# EAGLE design BATT_DCDC (EAGLE 9.6.2)
COMPANY: ADAFRUIT INDUSTRIES; DRAWN: KTOWN; REV: B
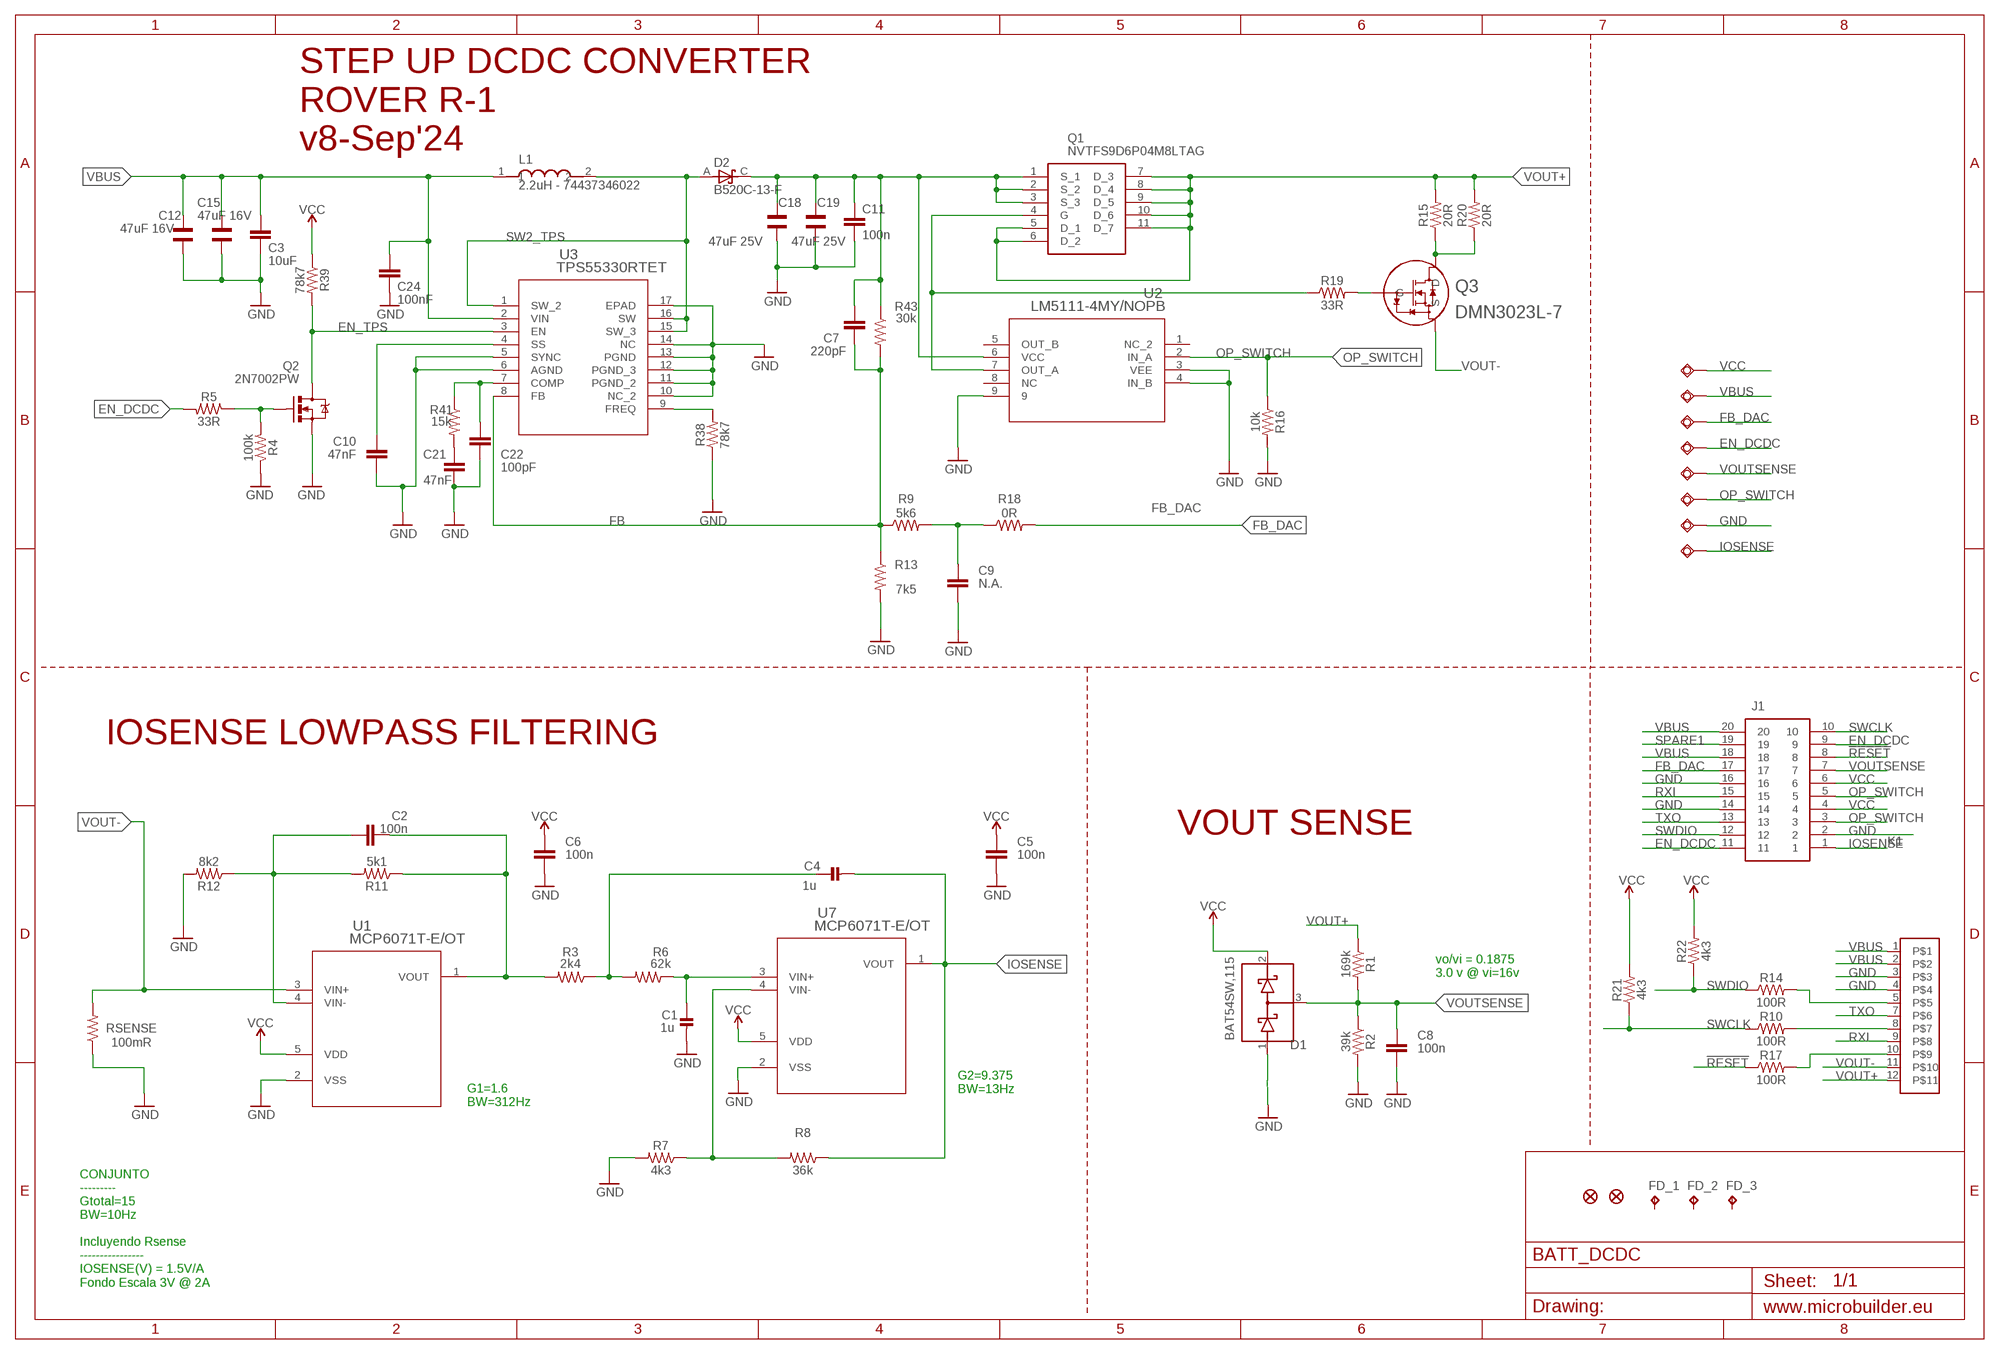
[diagram p0: schematic, sheet 1]

## Parts
C1  1u  CAP_CERAMIC0603_NO  [0603-NO]
C2  100n  0.1UF-0603-25V-(+80/-20%)  [0603]
C3  10uF  10UF-0805-10V-10%  [0805]
C4  1u  CAP_CERAMIC0603_NO  [0603-NO]
C5  100n  0.1UF-0603-25V-(+80/-20%)  [0603]
C6  100n  0.1UF-0603-25V-(+80/-20%)  [0603]
C7  220pF  270PF-0603-50V-5%  [0603]
C8  100n  0.1UF-0603-25V-(+80/-20%)  [0603]
C9  N.A.  0.1UF-0603-25V-(+80/-20%)  [0603]
C10  47nF  47NF-0603-25V-5%  [0603]
C11  100n  0.1UF-0603-25V-(+80/-20%)  [0603]
C12  47uF 16V  WCAP-CSGP_1210_885012109003  [WCAP-CSGP_1210]
C15  47uF 16V  WCAP-CSGP_1210_885012109003  [WCAP-CSGP_1210]
C18  47uF 25V  WCAP-CSGP_1210_885012109003  [WCAP-CSGP_1210]
C19  47uF 25V  WCAP-CSGP_1210_885012109003  [WCAP-CSGP_1210]
C21  47nF  2.2NF/2200PF-0603-50V-10%  [0603]
C22  100pF  270PF-0603-50V-5%  [0603]
C24  100nF  0.1UF-0603-25V-(+80/-20%)  [0603]
D1  BAT54SW,115  [SOT65P210X110-3N]
D2  B520C-13-F  [DIOM7959X250N]
EN_DCDC  TESTPAD_TPSQB1,27  [TESTPAD_B1,27]
FB_DAC  TESTPAD_TPSQB1,27  [TESTPAD_B1,27]
FD_1  FD_1  TPTP06SQ  [TP06SQ]
FD_2  FD_1  TPTP06SQ  [TP06SQ]
FD_3  FD_1  TPTP06SQ  [TP06SQ]
GND  TESTPAD_TPSQB1,27  [TESTPAD_B1,27]
IOSENSE  TESTPAD_TPSQB1,27  [TESTPAD_B1,27]
J1  DF40C-20DP-0.4V_51_  [DF40C-20DPA]
K1  FLEX11  [FLEX11]
L1  2.2uH - 74437346022  74437349100  [INDM7366X500]
OP_SWITCH  TESTPAD_TPSQB1,27  [TESTPAD_B1,27]
Q1  NVTFS9D6P04M8LTAG  [NVTFS5124PLTWG]
Q2  2N7002PW  MOSFET-NCHANNEL2N7002PW  [SOT323]
Q3  DMN3023L-7  PMV20XNERSOT23-TO-236AB_NEX-L  [SOT23-TO-236AB_NEX-L]
R1  169k  RESISTOR0402  [0402]
R2  39k  RESISTOR0402  [0402]
R3  2k4  RESISTOR0603  [0603]
R4  100k  RESISTOR0402  [0402]
R5  33R  RESISTOR0402  [0402]
R6  62k  RESISTOR0603  [0603]
R7  4k3  RESISTOR0603  [0603]
R8  36k  RESISTOR0603  [0603]
R9  5k6  RESISTOR0402  [0402]
R10  100R  RESISTOR0402  [0402]
R11  5k1  RESISTOR0402  [0402]
R12  8k2  RESISTOR0402  [0402]
R13  7k5  RESISTOR0402  [0402]
R14  100R  RESISTOR0402  [0402]
R15  20R  RESISTOR1206  [1206]
R16  10k  RESISTOR0402  [0402]
R17  100R  RESISTOR0402  [0402]
R18  0R  RESISTOR0402  [0402]
R19  33R  RESISTOR0402  [0402]
R20  20R  RESISTOR1206  [1206]
R21  4k3  RESISTOR0603  [0603]
R22  4k3  RESISTOR0402  [0402]
R38  78k7  RESISTOR0402  [0402]
R39  78k7  RESISTOR0402  [0402]
R41  15k  RESISTOR0402  [0402]
R43  30k  RESISTOR0402  [0402]
RSENSE  100mR  RESISTOR1206  [1206]
U1  MCP6071T-E/OT  [SOT-23-5_MC_MCH]
U2  LM5111-4MY/NOPB  [MUY08A]
U3  TPS55330RTET  [RTE16_1P66X1P66_TEX]
U7  MCP6071T-E/OT  [SOT-23-5_MC_MCH]
U$1  FIDUCIAL""  [FIDUCIAL_1MM]
U$2  FIDUCIAL""  [FIDUCIAL_1MM]
VBUS  TESTPAD_TPSQB1,27  [TESTPAD_B1,27]
VCC  TESTPAD_TPSQB1,27  [TESTPAD_B1,27]
VOUTSENSE  TESTPAD_TPSQB1,27  [TESTPAD_B1,27]

## Nets
!RESET: J1.8 R17.1
COMP_TPS: C22.2 R41.1 U3.7(COMP)
EN_DCDC: EN_DCDC.TP J1.9 J1.11 R5.2
EN_TPS: Q2.3(D) R39.2 U3.3(EN)
FB: C7.1 R9.1 R13.1 R43.2 U3.8(FB)
FB_DAC: FB_DAC.TP J1.17 R18.2
FREQ_TPS: R38.2 U3.9(FREQ)
GND: C1.2 C3.1 C5.2 C6.2 C8.2 C9.2 C10.2 C11.2 C12.1 C15.1 C18.1 C19.1 C21.1 C22.1 C24.1 D1.1(A) GND.TP J1.2 J1.14 J1.16 K1.3 K1.4 Q2.2(S) R2.2 R4.1 R7.2 R12.2 R13.2 R16.2 R38.1 RSENSE.1 U1.2(VSS) U2.3(VEE) U2.4(IN_B) U2.9 U3.5(SYNC) U3.6(AGND) U3.10(NC_2) U3.11(PGND_2) U3.12(PGND_3) U3.13(PGND) U3.14(NC) U3.17(EPAD) U7.2(VSS)
IOSENSE: C4.2 IOSENSE.TP J1.1 R8.1 U7.1(VOUT)
ISENSE_RAW: C2.1 R3.2 R11.1 U1.1(VOUT)
N$1: C2.2 R11.2 R12.1 U1.4(VIN-)
N$2: R7.1 R8.2 U7.4(VIN-)
N$3: C4.1 R3.1 R6.2
N$4: Q2.1(G) R4.2 R5.1
N$5: C1.1 R6.1 U7.3(VIN+)
N$6: K1.8 R10.2
N$8: Q3.3(D) R15.1 R20.1
N$9: Q1.4(G) R19.1 U2.7(OUT_A)
N$10: K1.10 R17.2
N$11: K1.5 R14.2
N$12: C9.1 R9.2 R18.1
N$13: Q3.1(G) R19.2
N$35: C10.1 U3.4(SS)
N$43: C21.2 R41.2
OP_SWITCH: J1.3 J1.5 OP_SWITCH.TP R16.1 U2.2(IN_A)
RXI: J1.15 K1.9
SPARE1: J1.19
SW2_TPS: D2.A L1.2 U3.1(SW_2) U3.15(SW_3) U3.16(SW)
SWCLK: J1.10 R10.1 R21.1
SWDIO: J1.12 R14.1 R22.1
TXO: J1.13 K1.7
VBUS: C3.2 C12.2 C15.2 C24.2 J1.18 J1.20 K1.1 K1.2 L1.1 U3.2(VIN) VBUS.TP
VCC: C5.1 C6.1 D1.2(C) J1.4 J1.6 R21.2 R22.2 R39.1 U1.5(VDD) U7.5(VDD) VCC.TP
VOUT+: K1.12 Q1.5(D_1) Q1.6(D_2) Q1.7(D_3) Q1.8(D_4) Q1.9(D_5) Q1.10(D_6) Q1.11(D_7) R1.1 R15.2 R20.2
VOUT-: K1.11 Q3.2(S) RSENSE.2 U1.3(VIN+)
VOUTSENSE: C8.1 D1.3(A-C) J1.7 R1.2 R2.1 VOUTSENSE.TP
VSOURCE: C7.2 C11.1 C18.2 C19.2 D2.C Q1.1(S_1) Q1.2(S_2) Q1.3(S_3) R43.1 U2.6(VCC)
Unconnected: FD_1.TP FD_2.TP FD_3.TP U2.1(NC_2) U2.5(OUT_B) U2.8(NC)

## Notes on the sheet
- STEP UP DCDC CONVERTER
  ROVER R-1
  v8-Sep'24
- IOSENSE LOWPASS FILTERING
- VOUT SENSE
- vo/vi = 0.1875
  3.0 v @ vi=16v
- G2=9.375
  BW=13Hz
- G1=1.6
  BW=312Hz
- CONJUNTO
  ---------
  Gtotal=15
  BW=10Hz
  
  Incluyendo Rsense
  ----------------
  IOSENSE(V) = 1.5V/A
  Fondo Escala 3V @ 2A

## Library data of the parts
C1 C4 = microbuilder:CAP_CERAMIC: Ceramic Capacitors For new designs, use the packages preceded by an '_' character since they are more reliable: The following footprints should be used on most boards: _0402 - Standard footprint for regular board layouts _0603 - Standard footprint for regular board layouts _0805 - Standard footprint for regular board layouts _1206 - Standard footprint for regular board layouts For extremely tight-pitch boards where space is at a premium, the following 'micro-pitch' footprints can be used (smaller pads, no silkscreen outline, etc.): _0402MP - Micro-pitch footprint for very dense/compact boards _0603MP - Micro-pitch footprint for very dense/compact boards _0805MP - Micro-pitch footprint for very dense/compact boards _1206MP - Micro-pitch footprint for very dense/compact boards
C2 C5 C6 C8 C9 C11 C24 = SparkFun-Capacitors:0.1UF: 0.1µF ceramic capacitors A capacitor is a passive two-terminal electrical component used to store electrical energy temporarily in an electric field.; PROD_ID: CAP-00810; VALUE: 0.1uF
C3 = SparkFun-Capacitors:10UF: 10.0µF ceramic capacitors A capacitor is a passive two-terminal electrical component used to store electrical energy temporarily in an electric field.; PROD_ID: CAP-11330
C7 C22 = SparkFun-Capacitors:270PF: 270pF/0.27nF ceramic capacitors A capacitor is a passive two-terminal electrical component used to store electrical energy temporarily in an electric field.; PROD_ID: CAP-13339; VALUE: 270PF
C10 = SparkFun-Capacitors:47NF: 47nF ceramic capacitors A capacitor is a passive two-terminal electrical component used to store electrical energy temporarily in an electric field.; PROD_ID: CAP-08605
C12 C15 C18 C19 = Wurth_Elektronik_Passive_Capacitors_rev19a:WCAP-CSGP_1210: WCAP-CSGP Ceramic Capacitors Characteristics Multilayer Ceramic Chip Capacitor Recommended soldering:Reflow, for 0603 and 0805 wave soldering is also allowed Operating temperature:-55 °C to +125 °C; Ceramic characteristics: Class I - NPO ; Class II -X7R, X5R High performance ceramic High capacitance stability Minimal aging Termination:Cu/Ni/Sn <http://katalog.we-online.de/media/images/eisos/WCAP-CSGP_pf2.jpg> Details see: http://katalog.we-online.de/en/pbs/WCAP-CSGP-1210? Created: 2015-01-28 2015 (C) Wurth Elektronik; WE-NUMBER: 885012109003/47uF
C21 = SparkFun-Capacitors:2.2NF/2200PF: 2.2nF/2,200pF ceramic capacitors A capacitor is a passive two-terminal electrical component used to store electrical energy temporarily in an electric field.; PROD_ID: CAP-07877; VALUE: 2.2nF
D1 = BAT54SW_115:BAT54SW,115: BAT54W Series 30 V 600 mA SMT Schottky Barrier Double Diode -SOT-323 Check availability <https://pricing.snapeda.com/parts/BAT54SW%2C115/Nexperia%20USA%20Inc./view-part?ref=eda>; AVAILABILITY: In Stock; DESCRIPTION: Diode Array 1 Pair Series Connection Schottky 30 V 200mA (DC) Surface Mount SC-70, SOT-323; MF: Nexperia USA Inc.; MP: BAT54SW,115; PACKAGE: SOT-323 Nexperia USA Inc.; PRICE: None; PURCHASE-URL: https://pricing.snapeda.com/search/part/BAT54SW,115/?ref=eda
D2 = B520C-13-F:B520C-13-F: 5.0A SURFACE MOUNT SCHOTTKY BARRIER RECTIFIER; AVAILABILITY: Unavailable; DESCRIPTION: Diode Schottky 20V 5A Surface Mount SMC; DIGIKEY-PURCHASE-URL: https://snapeda.com/shop?store=DigiKey&id=325969; MF: Diodes Inc.; MP: B520C-13-F; PACKAGE: DO-214 Diodes Inc.; PRICE: None
EN_DCDC FB_DAC GND IOSENSE OP_SWITCH VBUS VCC VOUTSENSE = BeagleBone_Blue_R3:TESTPAD_TPSQ: Test pad
FD_1-FD_3 = testpad:TP: Test pad
J1 = DF40C-20DP-0.4V_51_:DF40C-20DP-0.4V_51_: HIROSE(HRS) - DF40C-20DP-0.4V(51) - CONNECTOR, STACKING, HEADER, 20POS, 2ROW Source: Datasheet <https://datasheet.datasheetarchive.com/originals/distributors/Datasheets-DGA17/1059795.pdf>; ARROW_PART_NUMBER: DF40C-20DP-0.4V(51); ARROW_PRICE-STOCK: https://www.arrow.com/en/products/df40c-20dp-0.4v-51/hirose-electric; DESCRIPTION: HIROSE(HRS) - DF40C-20DP-0.4V(51) - CONNECTOR, STACKING, HEADER, 20POS, 2ROW; HEIGHT: mm; MANUFACTURER_NAME: Hirose; MANUFACTURER_PART_NUMBER: DF40C-20DP-0.4V(51); MOUSER_PART_NUMBER: 798-DF40C20DP0.4V51; MOUSER_PRICE-STOCK: https://www.mouser.co.uk/ProductDetail/Hirose-Connector/DF40C-20DP-0.4V51?qs=eDUdFcBPps31lPFyZ%252BXRFg%3D%3D
K1 = Flex_3mm:FLEX11
L1 = Inductance_2.2uH:74437349100: Inductor, SMD [Würth Elektronik] 74437349100 Inductor, SMD; DESCRIPTION: 10µH Shielded Molded Inductor 3.2A 69mOhm Max Nonstandard; DIGIKEY-PURCHASE-URL: https://snapeda.com/shop?store=DigiKey&id=586788; MF: Wurth Electronics; MP: 74437349100; PACKAGE: Nonstandard Wurth Electronics
Q1 = SamacSys_Parts:NVTFS9D6P04M8LTAG: MOSFET MV8 P INITIAL PROGRAM Source: Datasheet <https://www.onsemi.com/pub/Collateral/NVTFS9D6P04M8L-D.PDF>; DESCRIPTION: MOSFET MV8 P INITIAL PROGRAM; HEIGHT: 0.8mm; MANUFACTURER_NAME: ON Semiconductor; MANUFACTURER_PART_NUMBER: NVTFS9D6P04M8LTAG; MOUSER_PART_NUMBER: 863-NVTFS9D6P04M8LTG; MOUSER_PRICE-STOCK: https://www.mouser.co.uk/ProductDetail/ON-Semiconductor/NVTFS9D6P04M8LTAG/?qs=xZ%2FP%252Ba9zWqYALd8g5rll2Q%3D%3D
Q2 = SparkFun-DiscreteSemi:MOSFET-NCHANNEL: Common NMOSFET Parts MFG P/N Store ID Prod ID FDD8780 TRANS-09984 SI7820DN TRANS-11055 FDS6630A IC-08089 2N7002PW TRANS-11151 FQP30N06L COM-10213 TRANS-10060 BSS123LT1G TRANS-08345 BSS138 TRANS-00830 BS170 2N7000; PROD_ID: TRANS-11151
Q3 = PMV20XNER:PMV20XNER; COPYRIGHT: Copyright (C) 2023 Ultra Librarian. All rights reserved.; MANUFACTURER_PART_NUMBER: PMV20XNER; MFR_NAME: Nexperia
R1-R22 R38 R39 R41 R43 RSENSE = SparkFun-Resistors:RESISTOR: Generic Resistor Package
U1 U7 = MCP6071:MCP6071T-E/OT; BUILT_BY: EMA_Jessica; COPYRIGHT: Copyright (C) 2018 Accelerated Designs. All rights reserved; MANUFACTURER_PART_NUMBER: MCP6071T-E/OT; SOURCELIBRARY: Microchip_2019-08-23_21; VENDOR: Microchip
U2 = LM5111-4MY:LM5111-4MY/NOPB; COPYRIGHT: Copyright (C) 2024 Ultra Librarian. All rights reserved.; MANUFACTURER_PART_NUMBER: LM5111-4MY/NOPB; MFR_NAME: Texas Instruments; TYPE: LM5111-1MY
U3 = TPS55330:TPS55330RTET; BUILT_BY: EMA_UL_Team; MANUFACTURER_PART_NUMBER: TPS55330RTET; SOURCELIBRARY: TI_2015-1-5; VENDOR: Texas Instruments
U$1 U$2 = microbuilder:FIDUCIAL: Fiducial Alignment Points Various fiducial points for machine vision alignment.; BOM: EXCLUDE

## Net classes
2 gnd: width 0.305 mm, drill 0.483 mm, clearance 0.203 mm

## Board
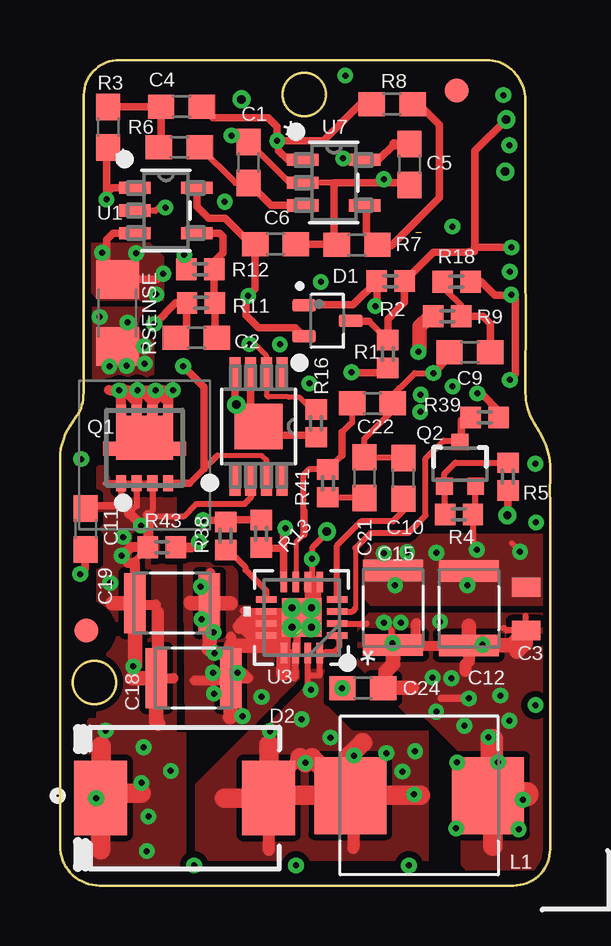
[diagram p1: board, top side]
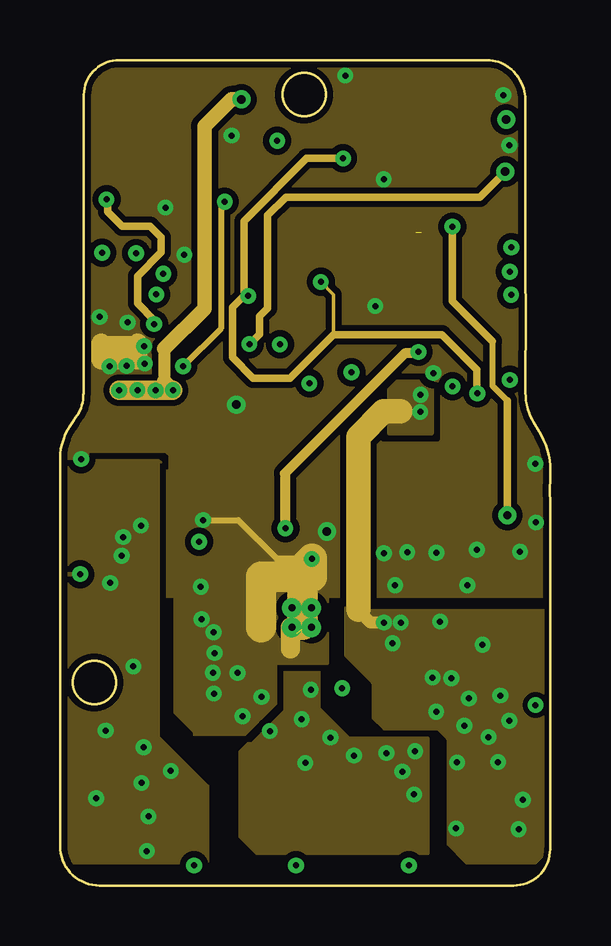
[diagram p2: board, inner layer Route2]
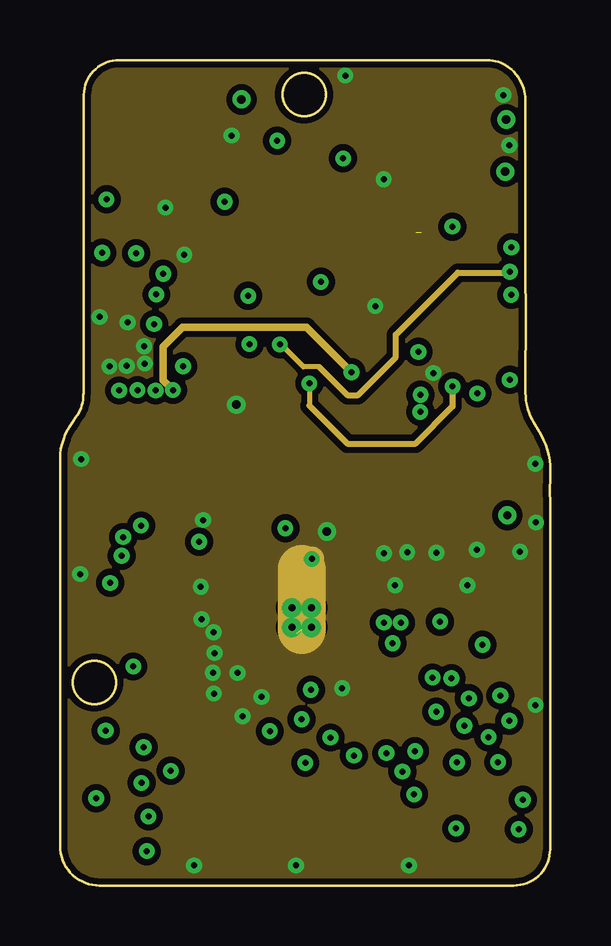
[diagram p3: board, inner layer Route15]
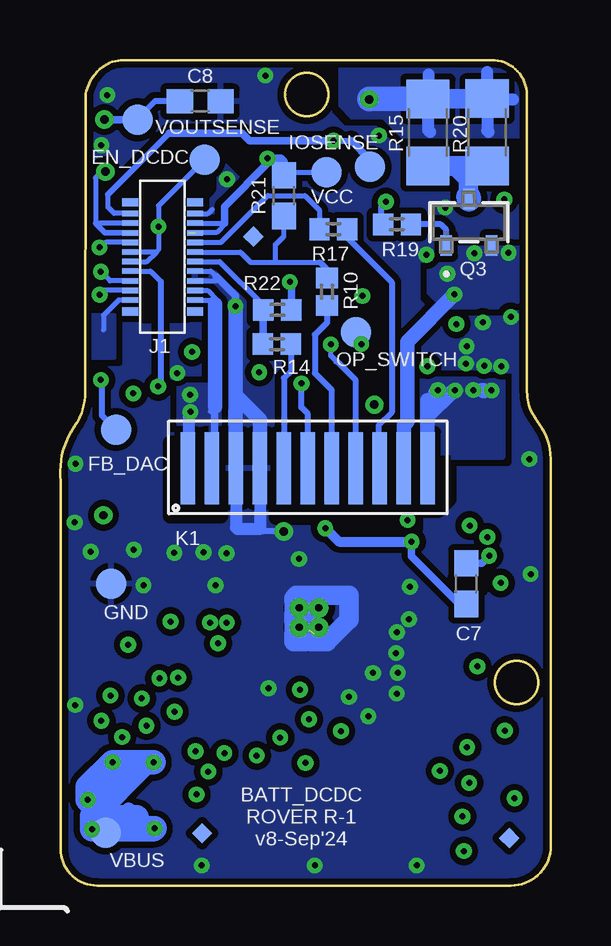
[diagram p4: board, bottom side, seen from below]

Size 20.45 x 34.4 mm. Coordinates in mm from the lower left corner, seen from the top.
Outline: 2.47,34.4 17.81,34.39 arc-37 18.71,34.1 arc-28 19.26,33.42 arc-25 19.4,32.76 arc0 19.4,30.25 arc0 19.4,27.73 arc1 19.41,25.27 arc-1 19.41,21.7 arc1 19.41,20.55 arc19 19.57,19.68 arc14 19.8,19.22 arc-8 20.16,18.59 arc-24 20.44,17.48 arc-4 20.44,16.88 arc4 20.44,16.05 20.44,1.52 arc-90 18.91,0 1.66,0 arc-90 0,1.65 arc90 0.01,1.66 0.01,17.78 arc-34 0.44,19.17 arc2 0.77,19.69 arc30 0.97,20.36 arc-23 1,20.54 1,32.94 arc-90 2.47,34.4
Outline: circle at 10.18,32.96 radius 0.9
Outline: circle at 1.43,8.46 radius 0.9
Copper layers (1+2*15+16): Top 0.035mm / dielectric 1.5mm / Route2 0.035mm / dielectric 0.15mm / Route15 0.035mm / dielectric 0.2mm / Bottom 0.035mm
Design rules "adafruit *": minimum track width 0.15mm, minimum drill 0.25mm, track to track 8mil, track to pad 8mil, pad to pad 8mil, via to via 8mil, smd to smd 5mil, copper to edge 8mil, drill to drill 8mil, minimum pad ring 10mil, minimum via ring 8mil, stop-mask expansion 2mil, vias tented up to drill 20mil, thermal gap 10mil
tRestrict: area 2.3,17.3 to 4.9,17.5
bRestrict: area 5.6,14.9 to 6.3,15.6; area 2.9,12.2 to 4,12.8; area 15.2,23.7 to 15.9,28.6; area 7,19.7 to 7.7,20.4; area 14.4,32.1 to 14.9,33.1; area 16.6,23.7 to 16.9,25.1; area 6.6,15.3 to 11.4,15.6; area 13.7,15.4 to 15.9,18.5; area 4.2,15.6 to 5.4,17.9; area 9.5,19.1 to 10,20.5; area 14.3,28.9 to 15.2,29.4; area 12.5,29.8 to 13.5,30.5

### Footprints (pad centres in the part's own frame; a part is rotated, then mirrored left to right if it is on the bottom)
0603-NO = smd 1.1 x 1: 1 -0.85,0; 2 0.85,0
0603 = smd 1.1 x 1: 1 -0.85,0; 2 0.85,0
0805 = smd 0.8 x 1.2: 1 -0.9,0; 2 0.9,0
WCAP-CSGP_1210 = smd 0.9 x 2.5: 1 -1.55,0; 2 1.55,0
SOT65P210X110-3N = smd 0.99 x 0.5: 1 -0.97,0.65; 2 -0.97,-0.65; 3 0.97,0
DIOM7959X250N = smd 2.2 x 3.1: A 3.5,0; C -3.5,0
TESTPAD_B1,27 = smd 1.27 x 1.27: TP 0,0
TP06SQ = smd 0.6 x 0.6: TP 0,0
DF40C-20DPA = smd 0.23 x 0.66: 1 0,0; 2 0,2.71; 3 0.4,0; 4 0.4,2.71; 5 0.8,0; 6 0.8,2.71; 7 1.2,0; 8 1.2,2.71; 9 1.6,0; 10 1.6,2.71; 11 2,0; 12 2,2.71; 13 2.4,0; 14 2.4,2.71; 15 2.8,0; 16 2.8,2.71; 17 3.2,0; 18 3.2,2.71; 19 3.6,0; 20 3.6,2.71 | smd 0.35 x 0.66: 21 4.075,0; 22 4.075,2.71; 23 -0.475,2.71; 24 -0.475,0
FLEX11 = smd 0.6 x 3: 1 0.8,2.05; 2 1.8,2.05; 3 2.8,2.05; 4 3.8,2.05; 5 4.8,2.05; 7 5.8,2.05; 8 6.8,2.05; 9 7.8,2.05; 10 8.8,2.05; 11 9.8,2.05; 12 10.8,2.05
INDM7366X500 = smd 3 x 3.2: 1 -2.87,0; 2 2.87,0
NVTFS5124PLTWG = smd 0.42 x 0.66: 1 -0.975,-1.47; 2 -0.325,-1.47; 3 0.325,-1.47; 4 0.975,-1.47 | smd 0.42 x 0.47: 5 0.975,1.565; 6 0.325,1.565; 7 -0.325,1.565; 8 -0.975,1.565 | smd 2.37 x 1.83: 9 0,0.415 | smd 0.545 x 0.57: 10 1.458,-0.035; 11 -1.458,-0.035
SOT323 = smd 0.7 x 0.7: 1 -0.65,-0.925; 2 0.65,-0.925; 3 0,0.925
SOT23-TO-236AB_NEX-L = smd 0.483 x 0.864: 1 -0.95,-0.965; 2 0.95,-0.965; 3 0,0.965
0402 = smd 0.85 x 0.9: 1 -0.58,0; 2 0.58,0
1206 = smd 1.6 x 1.8: 1 -1.4,0; 2 1.4,0
SOT-23-5_MC_MCH = smd 1.31 x 0.508: 1 -1.295,0.95; 2 -1.295,0; 3 -1.295,-0.95; 4 1.295,-0.95; 5 1.295,0.95
MUY08A = smd 1.372 x 0.457: 1 -2.197,0.975; 2 -2.197,0.325; 3 -2.197,-0.325; 4 -2.197,-0.975; 5 2.197,-0.975; 6 2.197,-0.325; 7 2.197,0.325; 8 2.197,0.975 | smd 1.88 x 2.007: 9 0,0
RTE16_1P66X1P66_TEX = smd 0.85 x 0.28: 1 -1.475,0.75; 2 -1.475,0.25; 3 -1.475,-0.25; 4 -1.475,-0.75; 9 1.475,-0.75; 10 1.475,-0.25; 11 1.475,0.25; 12 1.475,0.75 | smd 0.28 x 0.85: 5 -0.75,-1.475; 6 -0.25,-1.475; 7 0.25,-1.475; 8 0.75,-1.475; 13 0.75,1.475; 14 0.25,1.475; 15 -0.25,1.475; 16 -0.75,1.475 | smd 1.66 x 1.6: 17 0,0 | drill 0.305 pad 0.508: V -0.406,-0.406; V_1 -0.406,0.406; V_2 0.406,-0.406; V_3 0.406,0.406
FIDUCIAL_1MM = smd 1 x 1: 1 0,0

### Placement (x,y rotation side)
C1  7.87,30.13 90 top
C2  5.69,22.82 0 top
C3  19.43,11.53 270 top
C4  5.07,32.46 0 top
C5  14.57,30.05 270 top
C6  8.99,26.72 0 top
C7  3.52,12.58 90 bottom
C8  14.62,32.68 0 bottom
C9  17.09,22.23 180 top
C10  14.32,16.97 90 top
C11  1.07,14.86 270 top
C12  17.05,11.56 270 top
C15  13.89,11.58 270 top
C18  5.57,8.64 180 top
C19  4.68,11.77 180 top
C21  12.69,17 270 top
C22  13.03,20.09 180 top
C24  12.63,8.22 0 top
D1  11.15,23.53 0 top
D2  5.2,3.65 0 top
EN_DCDC  14.44,30.25 0 bottom
FB_DAC  18.13,19 0 bottom
FD_1  12.4,27.04 315 bottom
FD_2  1.73,1.98 315 bottom
FD_3  14.54,2.18 315 bottom
GND  18.34,12.58 0 bottom
IOSENSE  7.53,29.95 0 bottom
J1  17.55,28 270 bottom
K1  15.93,15.34 0 bottom
L1  14.98,3.75 180 top
OP_SWITCH  8.12,23.06 0 bottom
Q1  3.53,18.24 0 top
Q2  16.68,17.56 0 top
Q3  3.41,27.64 0 bottom
R1  13.67,22.15 90 top
R2  13.79,25.19 180 top
R3  2.01,31.6 270 top
R4  16.64,15.47 180 top
R5  18.68,17.04 270 top
R6  4.98,30.77 180 top
R7  12.39,26.7 180 top
R8  13.85,32.56 0 top
R9  16.15,23.73 0 top
R10  9.33,24.75 270 bottom
R11  5.88,24.28 0 top
R12  5.85,25.68 180 top
R13  8.39,14.66 90 top
R14  11.42,22.57 0 bottom
R15  5.12,31.38 90 bottom
R16  10.68,19.26 270 top
R17  9.07,27.35 0 bottom
R18  16.54,25.16 0 top
R19  6.41,27.55 0 bottom
R20  2.65,31.39 90 bottom
R21  11.13,28.75 90 bottom
R22  11.4,23.99 0 bottom
R38  6.91,14.57 270 top
R39  17.71,19.5 180 top
R41  11.17,16.76 270 top
R43  4.25,14.1 0 top
RSENSE  2.4,23.86 90 top
U1  4.42,28.13 0 top
U2  8.28,19.13 270 top
U3  10.08,11.17 180 top
U7  11.42,29.29 0 top
U$1  16.55,33.13 90 top
U$2  1.1,10.63 90 top
VBUS  18.56,2.2 0 bottom
VCC  9.35,29.73 0 bottom
VOUTSENSE  17.23,31.91 0 bottom

### Tracks (layer width: path | path; a pad name or v marks a point on that pad's centre or on a via)
!RESET
  Bottom 0.203: J1.8 13.76,26.8 11.8,28.75 10.26,28.75 9.65,28.14 R17.1
COMP_TPS
  Top 0.203: U3.7 9.85,12.66 9.85,14.3 10.18,14.63
  Top 0.254: C22.2 12.18,19.3 11.76,18.88 | 11.76,17.93 R41.1 10.38,17.34 10.14,17.1 10.14,15.63 10.18,15.59
  Top 0.305: 10.18,14.63 10.18,15.59 | 11.76,18.88 11.76,17.93
EN_DCDC  (via drill 0.25, 0.35)
  Top 0.203: 18.68,15.45 v18.66,15.43
  Top 0.305: R5.2 18.68,15.45
  Route2 0.203: v16.37,27.45 v16.36,27.46
  Route2 0.254: 18.04,22.68 18.04,20.82 18.66,20.2
  Route2 0.305: v18.66,15.43 18.66,20.2 | v16.37,27.45 16.37,24.34 18.04,22.68
  Bottom 0.203: 16.45,26.4 16.36,26.48 v16.36,27.46 16.36,28.33 EN_DCDC.TP | J1.11 16.85,26 16.45,26.4 | 16.45,26.4 J1.9
EN_TPS
  Top 0.203: 12.32,14.06 12.32,11.55 | Q2.3 16.7,18.5 16.7,18.54 16.73,18.54 | R39.2 16.84,19.5 16.73,19.4
  Top 0.254: U3.3 12.19,11.42 12.32,11.55 | 12.32,14.06 12.95,14.69 14.52,14.69 15.24,15.42 15.24,17.79 16,18.54 16.7,18.54
  Top 0.305: 16.73,19.4 16.73,18.54
FB  (via drill 0.25)
  Top 0.203: 5.75,14.33 v5.8,14.33 | v9.4,14.89 9.38,14.89 9.33,14.84
  Top 0.305: 9.33,14.84 9.33,14.05 | 9.33,14.05 U3.8 | 9.33,14.05 8.42,14.05 R13.1
  Top 0.406: R43.2 5.52,14.1 5.75,14.33
  Top 0.61: R9.1 15.54,23.69 15.4,23.69 14.99,23.28 14.99,22.27 v14.95,22.23
  Route2 0.406: v14.95,22.23 14.95,22.18 14.38,22.18 9.38,17.18 9.38,14.91 v9.4,14.89
  Bottom 0.305: v5.8,14.33 5.8,13.73 3.8,11.73 C7.1
  Bottom 0.406: v9.4,14.89 8.84,14.33 v5.8,14.33
FB_DAC  (via drill 0.25)
  Top 0.305: v18.76,21.07 18.99,21.3 18.99,24.43 v18.82,24.61 18.8,24.6 18.14,24.6 17.58,25.16 R18.2
  Bottom 0.203: J1.17 18.63,24.8 v18.82,24.61 | v18.76,21.07 18.72,21.03
  Bottom 0.254: 18.72,21.03 18.72,19.59 FB_DAC.TP
FREQ_TPS
  Top 0.203: U3.9 8.6,11.93
  Top 0.254: 8.6,11.93 8.6,12.3 7.74,13.16 7.74,13.27 7.01,13.99 R38.2
GND  (via drill 0.25, 0.35)  (1 unrouted)
  Top 0.15: 6.44,10.58 v6.42,10.56 v6.41,10.56
  Top 0.2: 10.33,12.34 10.33,12.3 | U3.5 | U2.9 v7.37,20.04 v7.36,20.04
  Top 0.203: 18.84,14.27 19.18,13.93 v19.18,13.91 | R4.1 17.33,15.58 | v17.38,14 17.22,14.17 | v7.16,31.25 7.6,31.25 C1.2 | R12.2 5.27,26.29 v5.18,26.29 | C6.2 | C9.2 16.24,22.03 | C24.1 v11.77,8.22
  Top 0.254: U3.12 8.55,10.37 | U3.14 9.83,9.63 | 9.33,9.63 U3.13 | U1.2 3.94,28.13 3.97,28.1 4.12,28.25 v4.4,28.25 | C19.1 5.93,12.07 5.93,12.41 6.27,12.75 | C1.2 8.17,30.68 8.18,30.68 9.57,29.29 U7.2 11.43,29.29 11.38,29.24 11.43,29.19 | 17.33,15.58 Q2.2 | R4.1 17.22,14.17 | 11.52,26.72 R7.2 | 10.59,12.62 10.54,12.68 10.54,14.1 11.16,14.72 | R38.1 6.83,15.23 | 11.16,14.72 11.16,14.75 | 11.16,14.72 v11.13,14.76 | C10.2 14.29,17.85 C21.1 12.69,18.61 13.88,19.8 C22.1 13.88,20.45 14.15,20.73 14.17,20.73 14.8,21.36 v15.57,21.36
  Top 0.305: U3.10 8.6,11.41 7.71,11.41 7.66,11.46 | U3.11 7.61,10.92 7.49,10.8 7.51,10.79 7.87,10.42 U3.12 | U3.10 8.6,10.84 | 8.6,10.84 U3.12 | U3.12 8.6,9.81 8.73,9.7 U3.14 | U3.6 10.33,12.34 | U3.17 10.36,11.45 10.36,12.62 U3.6 | U3.17 10.74,11.83 10.74,12.56 U3.5 10.81,12.62 10.59,12.62 10.35,12.62 U3.6 | U3.17 9.83,11.42 U3.10 | U3.17 9.75,10.84 8.6,10.84 | U3.17 9.59,10.68 8.87,10.68 U3.12 | 9.33,10.42 U3.13 9.33,8.83 9.33,8.78 9.32,8.77 | U3.17 9.88,10.97 9.88,9.74 U3.14 | U3.14 9.8,9.66 9.8,8.71 9.75,8.66 | v6.45,9.69 v6.45,9.7 6.28,9.87 6.2,9.87 | 7.11,11.77 7.18,11.84 | R7.2 11.43,26.81 11.43,29.19 | C6.2 11.52,26.72 | R13.2 7,15.24 R38.1 | 6.83,15.23 v5.97,15.23 | D1.1 10.18,24.2 12.22,24.2 R2.2 13.21,24.15 v13.15,24.15 | 16.24,22.03 v15.57,21.36 | C5.2 14.48,29.29 11.43,29.29 | RSENSE.1 v3.51,22.46 v3.51,22.47 | U2.4 7.3,20.09 v7.36,20.04 | U2.3 7.96,19.45 U2.9 8.64,18.77 10.59,18.77 R16.2 | v0.84,12.98 1.05,13.19 1.05,13.99 C11.2
  Top 0.406: C18.1 7.03,8.55 5.62,8.55 | 7.13,10.37 7.13,9.99 C18.1 | 6.28,13.02 6.28,11.51 6.23,11.56 C19.1 6.23,11.79 | C18.1 7.86,8.64 7.64,8.86 v7.41,8.86
  Top 0.61: 5.45,11.79 5.47,11.77 C19.1 | C19.1 7.11,11.77 | C19.1 6.23,9.9 6.2,9.87 | C18.1 7.12,7.04 7.09,7.01 | U3.17 10.02,11.11 7.8,11.11 7.61,10.92 | U3.17 9.7,10.79 7.51,10.79 | U3.17 9.33,10.42 9.33,8.83 | U3.17 8.9,9.99 7.13,9.99 | U3.17 10.59,11.68 10.59,12.62
  Route2 0.254: v10.5,13.61 9.05,13.61 7.43,15.23 v5.97,15.23
  Route2 0.61: 1.72,22.59 3.23,22.59
  Route2 0.813: 9.62,10.76 9.62,9.86 | 3.23,22.59 3.23,21.91 1.72,21.91 1.72,22.59
  Route2 1.27: 8.38,10.76 8.38,12.87 10.5,12.87 v10.5,13.61 10.12,13.23 10.12,10.86
  Route15 0.813: 9.79,10.44 9.81,10.44 9.87,10.5
  Route15 1.016: v10.5,13.61 10.07,13.18
  Route15 2: 10.07,13.18 10.07,10.66
  Bottom 0.15: 13.96,25.2 13.96,25.39
  Bottom 0.203: J1.2 14.29,28 14.12,28.17 | 13.96,25.39 14.17,25.6 J1.14 | J1.16 13.96,25.2
  Bottom 0.254: v11.13,14.76 12.02,14.76 12.13,14.86
  Bottom 0.305: v13.15,24.15 13.15,24.58 13.96,25.39
  Bottom 0.5: K1.4 12.13,14.86 | 12.13,14.86 | K1.3 13.13,14.93 13.13,14.92 13.07,14.86 12.13,14.86
  Bottom 0.61: v13.15,24.15 v13.14,24.14 13.14,20.43 | 13.14,20.43 13.14,17.41 K1.3 | K1.4 12.13,19.41 13.14,20.43
  Bottom 0.813: 9.97,11.21 9.97,10.16 9.33,10.16 8.42,11.07 8.42,12.09 10.6,12.09 10.71,11.98 10.71,10.17 10.25,10.17
  other vias: 14.48,13.89 15.7,13.87 16.99,12.52 13.98,12.52 13.52,13.85 8.41,7.86 7.61,7.06 6.42,8 6.38,8.87 5.91,11.1 5.87,12.45 11.9,33.75 18.49,32.94 13.5,29.43 0.89,17.77 5.59,0.84 9.84,0.84 14.55,0.84 19.83,7.52 19.85,15.13 19.82,17.58 18.74,30.85 3.54,21.75 1.66,23.69 2.07,21.63 2.83,23.46 2.78,21.65
  pour Top (isolate 0.003): 5.26,6.75 5.18,13.46 7.39,13.46 7.39,11.66 10.04,11.66 10.04,8.68 8.11,6.75
  pour Top (isolate 0.254, no thermals): 20.3,11.76 20.3,14.55 13.04,14.55 11.63,13.14 13.01,11.76
  pour Bottom (isolate 0.26, rank 3): 22.91,-1 22.91,35.68 -0.83,35.68 -0.83,0.39 0.56,-1
  pour Route2 (isolate 0.254): 5.6,6.31 7.71,6.31 8.98,7.58 8.98,9.26 11.15,9.26 11.15,12.64 4.8,12.64 4.8,7.2 5.62,6.38
  pour Route15 (isolate 0.254, rank 2): 23.02,-0.98 23.02,35.6 -0.77,35.6 -0.77,-0.98
  pour Top (isolate 0.305, no thermals): 1.28,24.07 1.28,21.17 1.41,21.04 3.9,21.04 3.9,24.07
  pour Route2 (isolate 0.254, rank 3): -0.81,35.29 -0.81,12.03 22.39,12.03 22.39,35.29
IOSENSE  (via drill 0.25)
  Top 0.254: U7.1 9.51,30.24
  Top 0.305: C4.2 6.38,32 8.68,32 9.06,31.61 v9.06,31.04 | 9.51,30.24 9.12,30.62 9.12,30.98 v9.06,31.04 | R8.1 12.51,32.56 10.99,31.04 v9.06,31.04
  Bottom 0.203: 18.46,28.8 18.46,28.26 18.21,28.01 J1.1
  Bottom 0.254: 18.46,28.8 15.91,31.35 | v9.06,31.04 8.32,31.04
  Bottom 0.305: 8.32,31.04 7.53,30.25 IOSENSE.TP | 15.91,31.35 12.86,31.35 12.55,31.04 v9.06,31.04
ISENSE_RAW  (via drill 0.25)
  Top 0.203: v3.94,23.4 v3.93,23.4
  Top 0.254: R3.2 2.01,30.72 1.94,30.65
  Top 0.305: U1.1 2.17,29.07 1.94,28.84 v1.94,28.59 1.94,30.65 | C2.1 5.29,23.27 R11.1 4.82,24.28 v3.94,23.4
  Route2 0.203: v1.94,28.59 1.98,28.55
  Route2 0.305: 1.98,28.55 1.98,28.07 2.59,27.47 3.77,27.47 4.23,27.01 4.23,26.39 3.23,25.4 3.23,24.26 3.93,23.56 v3.93,23.4
N$1
  Top 0.203: C2.2 6.46,22.9 | R11.2 6.43,24.31
  Top 0.305: 6.46,22.9 R11.2 | 6.43,24.31 R12.1 6.43,25.99 6.8,26.36 6.8,27.04 6.66,27.18 U1.4
N$2
  Top 0.254: 12.78,28.34 U7.4 | R8.2 14.97,32.56 | R7.1 | R7.1 13.24,26.67
  Top 0.305: 14.97,32.56 15.82,31.71 15.82,28.66 13.83,26.67 13.24,26.67 | R7.1 12.78,27.16 12.78,28.34
N$3
  Top 0.254: R3.1 | R6.2 4.22,30.86
  Top 0.305: R3.1 C4.1 4.22,30.86
N$4
  Top 0.203: 16.06,16.61 Q2.1
  Top 0.254: Q2.1 16.03,17.16 16.49,17.62 R5.1 | R4.2 16.06,16.61
N$5
  Top 0.254: R6.1 7.32,29.28 C1.1
  Top 0.305: U7.3 8.81,28.34 C1.1
N$6
  Bottom 0.254: K1.8 9.13,20.65 9.83,21.36 9.83,22.95 9.33,23.45 R10.2
N$7
  pour Route15 (isolate 0.254): 5.67,15.56 5.67,14.98 6.26,14.98 6.26,15.56
N$8
  Bottom 0.254: 4.94,29.99 R15.1
  Bottom 0.813: R20.1 4.94,29.99 | 3.43,29.57 3.43,28.71 | 3.43,28.66 3.43,29.43 3.98,29.98 R15.1
  Bottom 1.016: 3.43,28.71 3.41,28.64 Q3.3 | 3.43,29.57 3.01,29.99 R20.1
N$9  (via drill 0.25)
  Top 0.2: 8.41,17.92 6.56,17.92
  Top 0.203: 8.6,17.73 8.41,17.92
  Top 0.254: U2.7 8.6,17.73 | 6.56,17.92 6.02,17.38 5.41,16.77
  Top 0.305: 5.41,16.77 Q1.4 | v5.14,21.64 6.02,20.76 6.02,17.38
  Route2 0.254: v5.14,21.64 6.71,23.21 6.71,28.35 v6.86,28.49 v6.87,28.49
  Bottom 0.254: v6.87,28.49 7.08,28.28 7.08,27.64 R19.1
N$10
  Bottom 0.254: R17.2 8.49,27 6.63,25.14 6.63,19.72 7.18,19.17 7.18,17.45 K1.10
N$11
  Bottom 0.254: R14.2 10.84,21.44 11.13,21.16 K1.5
N$12
  Top 0.254: R18.1 16.12,25 16.12,24.79 16.47,24.44 16.48,24.44 16.73,24.19 R9.2
  Top 0.305: R9.2 17.63,23.73 17.94,23.41 C9.1
N$13
  Bottom 0.254: Q3.1 4.36,27.32 4.59,27.55 R19.2
N$35
  Top 0.254: U3.4 11.55,14.18 12.55,15.18 13.89,15.18 14.32,15.61 C10.1
N$43
  Top 0.254: R41.2 12.66,16.18 C21.2
OP_SWITCH  (via drill 0.25, 0.35)
  Top 0.152: 9.54,20.34 9.52,20.36 | 8.68,20.36 8.67,20.37
  Top 0.2: v7.9,22.56 8.13,22.56 8.61,22.08 U2.2 8.6,20.44 8.67,20.37 | R16.1 10.5,19.84 10,20.34 9.54,20.34 | 9.52,20.36 8.68,20.36
  Route2 0.305: v18.57,29.75 17.51,28.69 9.42,28.69 8.66,27.93 8.66,24.07 8.32,23.72 8.32,22.98 v7.9,22.56
  Bottom 0.2: OP_SWITCH.TP 8.12,22.78 v7.9,22.56
  Bottom 0.203: v18.57,29.75 18.72,29.75 18.99,29.48 18.99,27.6 18.59,27.2 J1.5 18.6,27.2 18.98,27.59 18.96,27.6 J1.3
RXI  (via drill 0.25)
  Route15 0.2: v9.17,22.55 9.22,22.55
  Route15 0.203: 10.81,21.61 10.15,21.61 9.22,22.55 | 18.72,25.54 v18.76,25.58
  Route15 0.254: 10.81,21.61 11.98,20.44 12.43,20.44 14.01,22.02 14.01,22.96 16.59,25.54 18.72,25.54
  Bottom 0.2: 8.94,21.84 9.17,22.07 v9.17,22.55
  Bottom 0.203: v18.76,25.58 18.38,25.2 J1.15
  Bottom 0.254: K1.9 8.13,21.05 8.91,21.84 8.94,21.84
SPARE1
  Bottom 0.203: J1.19 18.02,24.4 18.65,23.77 18.65,23.15
  pour Bottom: 18.2,23.75 19.12,23.75 19.12,22.02 18.2,22.02
SW2_TPS  (via drill 0.25)
  Top 0.15: U3.16 10.93,9.6
  Top 0.2: v10.46,8.16 v10.47,8.16 10.5,8.19
  Top 0.203: 10.5,8.19 10.33,8.02
  Top 0.254: 10.93,9.6 11.05,9.72 11.41,9.72 11.63,9.94 11.63,10.27 11.55,10.35 U3.1 | U3.15 | U3.15 10.33,8.75 | 10.33,8.75 10.33,8.02 | U3.16 10.83,9.61 | 10.83,9.61 | 10.83,9.61 10.83,8.77 10.81,8.75 10.33,8.75
  Top 0.508: D2.A 8.81,3.76 | D2.A 8.33,3.65 8.12,3.86 | D2.A 8.7,1.49 | D2.A 8.72,3.67 | L1.2 12.23,3.63 12.23,1.57 | 10.01,5.33 8.7,4.02
  Top 0.61: 10.52,5.32 10.44,5.32 v10.23,5.11
  Top 0.813: 8.72,3.67 8.72,5.86 | 8.81,3.76 15.03,3.76 | 12.62,5.96 12.11,5.45 L1.2 12.09,3.75 10.52,5.32 | 6.86,3.64 6.87,3.65 D2.A 8.7,4.02 | 10.01,5.33 v10.23,5.11
  other vias: 12.26,5.42 11.28,6.17 8.75,6.44 14.81,5.6 14.77,3.8 10.08,6.93 13.61,5.52 14.28,4.75
  pour Top (isolate 0.254, rank 2): 15.36,1.06 15.36,6.44 12.19,6.44 11.04,7.59 11.04,10.48 10.08,10.48 10.08,8.66 5.63,4.21 5.63,1.06
  pour Route2 (isolate 0.254, rank 2, no thermals): 15.35,1.34 15.35,6.14 12.05,6.14 10.8,7.39 10.8,9.94 10.5,10.24 9.2,10.24 9.2,7.28 7.5,5.58 7.5,2.04 8.2,1.34
SWCLK
  Bottom 0.203: J1.10 12.95,26.4 12.52,25.97 11.49,25.97 | 11.49,25.97 9.63,25.97 | 11.49,25.97 11.49,26.69 11.13,27.05 R21.1
  Bottom 0.254: R10.1 9.33,25.68 9.63,25.97
SWDIO
  Bottom 0.152: 11.81,24.01 12,23.82
  Bottom 0.203: J1.12 13.8,26 12,24.2 12,23.82
  Bottom 0.254: R22.1 11.83,23.99 11.81,24.01
  Bottom 0.305: R14.1 12,23.82
TXO  (via drill 0.25)
  Route15 0.203: v10.4,20.92 10.4,20
  Route15 0.254: 10.4,20 11.98,18.42 14.82,18.42 16.37,19.96 v16.37,20.8
  Bottom 0.203: J1.13 16.69,25.6 16.27,25.18 | 16.27,20.91 v16.37,20.8
  Bottom 0.254: 16.27,25.18 16.27,20.91 | K1.7 10.13,19.66 10.4,19.93 v10.4,20.92
VBUS  (via drill 0.25)
  Top 0.203: 11.86,10.91 11.89,10.88 11.6,10.88 U3.2 | 12.78,10.91 12.81,10.94
  Top 0.254: 11.86,10.91 12.78,10.91 | v13.51,10.96 v13.52,10.96 13.8,10.68 13.8,10.03 C15.2 | 19.42,11.24 19.42,10.64 C3.2 18.62,10.63 18.51,10.74
  Top 0.305: 15.9,7.8 v17.05,7.8 | C12.2 17.29,10.01
  Top 0.406: 17.29,10.01 17.32,9.98 | C15.2 14.84,10.03 14.85,10.02 | 16.13,9.91 16.07,9.97 14.9,9.97 14.85,10.02 | 14.85,10.02 14.85,10.95
  Top 0.508: L1.1 17.64,3.96 17.22,3.96 | L1.1 18.06,3.54 | L1.1 18.07,3.97 | 13.95,9.47 13.89,9.53 C15.2 | C12.2 17.05,9.35 16.92,9.22 16.92,8.94
  Top 0.61: C15.2 13.89,9.22 13.58,8.91 13.58,8.32 C24.2 13.5,8.24 14.68,8.24 | C3.2 18.82,10.01 C12.2 17.05,10.82 | 19.43,10.12 19.05,9.74 19.05,10.25 | L1.1 17.85,6.16 v17.87,6.18 v17.87,6.19
  Top 0.813: 18.06,3.54 18.06,1.64 | 18.07,3.97 18.07,6.11
  Top 1.016: 19.45,3.81 17.91,3.81 L1.1
  Route2 0.508: v13.51,10.96 12.96,10.96 12.44,11.48
  Route2 1.016: 12.44,11.48 12.44,18.7 13.49,19.76 14.19,19.76
  Bottom 0.203: J1.20 14.18,24.4 | 14.18,24.4 13.91,24.4 14.31,24.8 J1.18 | 14.18,24.4 14,24.22 | 14,19.95 14.19,19.76
  Bottom 0.305: 14.02,19.74 14.02,18.38
  Bottom 0.406: 14.99,19.68 14.98,19.69 v15.02,19.73
  Bottom 0.508: 15.11,19.68 15.11,18.32
  Bottom 0.61: 14,24.22 14,19.95 | VBUS.TP 17.6,3.17 17.27,2.84 16.81,2.38
  Bottom 1.016: 17.27,2.84 18.56,2.84 v19.3,3.58 19.3,4.12 v18.27,5.15 16.58,5.15 v16.56,5.13 16.92,5.13 19.13,2.92 v19.13,2.35 16.55,2.35 v16.52,2.38 16.81,2.38
  other vias: 17.62,10.04 16.86,6.66 16.32,8.64 14.21,10.96 13.87,10.1 18.36,7.92 18.74,6.87 15.85,11 15.54,8.67 15.69,7.24 15.04,20.45
  pour Top (isolate 0.254, rank 2): 20.35,0.66 20.35,11.35 12.88,11.35 12.41,10.88 12.41,9.18 14.53,7.06 15.15,7.06 16.72,5.49 16.72,0.86 16.92,0.66
  pour Route2 (isolate 0.305): 13.76,20.99 15.48,20.99 15.48,18.84 13.76,18.84
  pour Bottom: 13.8,20.84 15.51,20.84 15.51,18.67 15.09,18.66 13.8,18.66
  pour Route2: 11.89,11.61 11.89,9.57 13.03,8.43 13.03,6.98 13.5,6.51 15.73,6.51 16.15,6.09 16.15,1.72 16.93,0.94 19.85,0.94 20.79,1.88 20.79,11.48 12.02,11.48
VCC  (via drill 0.25)  (1 unrouted)
  Top 0.203: U7.5 12.66,30.3 | 18.29,19.79 R39.1 | v7.85,24.57 7.83,24.59 7.77,24.53
  Top 0.305: U1.5 5.72,28.29 6.2,27.81 6.88,27.81 7.97,26.72 C6.1 8.14,24.86 v7.85,24.57 | 12.66,30.3 v11.81,30.3 | v17.41,20.5 17.57,20.5 18.29,19.79 | U7.5 13.28,30.24 13.94,30.9 | D1.2 9.81,23.25 8.29,23.25 7.77,23.77 7.77,24.53
  Top 0.406: 13.94,30.9 C5.1
  Route2 0.152: v10.88,25.15 11.41,24.62 11.41,22.95
  Route2 0.203: v17.41,20.5 17.38,20.52
  Route2 0.254: v7.85,24.57 7.82,24.54 7.63,24.54
  Route2 0.305: v11.81,30.3 10.29,30.3 7.68,27.69 7.68,24.74 v7.85,24.57 | 17.38,20.52 17.38,21.5 15.93,22.95 11.41,22.95 9.6,21.14 8.06,21.14 7.2,22 7.2,24.11 7.63,24.54
  Bottom 0.152: R21.2 11.13,29.62 11.24,29.73 | v10.88,25.15
  Bottom 0.203: 11.24,29.73 VCC.TP | J1.4 13.61,27.6 13.56,27.6 13.55,27.59 13.94,27.21 15.08,27.21
  Bottom 0.305: 13.61,27.6 13.61,28.29 11.81,30.09 v11.81,30.3 11.24,30.3 11.13,30.19 R21.2 | R22.2 10.82,25.09 v10.88,25.15
VOUT+  (via drill 0.25, 0.35)
  Top 0.254: 2.09,18.18 Q1.11 | v12.16,21.39 12.18,21.36 | 13.46,21.36 R1.1
  Top 0.305: 13.46,21.36 12.18,21.36
  Top 0.406: v2.47,20.63 v2.48,20.63 | Q1.6 3.86,20.18 3.39,20.65 v3.23,20.65 3.23,20.16 3.21,20.14 Q1.7 | v4.71,20.65 4.52,20.65 | 2.05,20.65 2.74,20.65 2.75,20.64 | 2.75,20.64 4.26,20.64 | 4.26,20.64 v4.7,20.64 v4.71,20.65 | 4.52,20.14 4.23,20.43 | 4.26,20.64 4.34,20.55 4.23,20.43 | v4.71,20.65 4.52,20.45 4.52,20.14 | 4.52,20.14 4.52,19.82 | 4.52,19.82 Q1.5 | Q1.7 3.21,20.18 2.75,20.64 | Q1.6 3.86,20.11 4.17,20.43 4.2,20.41 4.23,20.43 | Q1.11 3.08,18.2 Q1.9 3.86,18.98 Q1.6 | Q1.8 2.55,20.68 2.61,20.73 3.21,20.12 Q1.7 | 4.52,19.82 4.52,18.33 4.64,18.2 Q1.10
  Route2 0.508: 4.35,22.36 4.35,21.01 | v4.71,20.65 4.69,20.63 | 3.25,20.63 v3.23,20.65 3.21,20.63
  Route2 0.61: v7.57,32.76 7.15,32.76 6.02,31.64 6.02,24.04 4.35,22.36 | v4.71,20.65 4.35,21.01
  Route2 0.813: 4.69,20.63 v3.99,20.63 3.25,20.63 | 3.21,20.63 v2.47,20.63
  Route15 0.305: v4.71,20.65 4.31,21.05 4.31,22.46 5.12,23.27 10.27,23.27 v12.16,21.39
  Bottom 0.406: 5.15,20.21 4.82,20.54
  Bottom 0.508: R20.2 2.65,33.89 | 5.09,33.79 5.09,32.81 R15.2 5.12,31.49 5.03,31.4 | R20.2 2.65,31.46 2.6,31.41 | R20.2 2.62,32.76 1.58,32.76
  Bottom 0.61: 2.88,20.64 2.79,20.64 2.79,20.6 | 4.82,20.54 v4.71,20.65 | 5.12,19.57 4.09,20.61 4.02,20.61 v3.99,20.63 | 5.15,20.21 5.15,17.41 K1.12
  Bottom 0.813: R20.2 R15.2
  Bottom 1.016: R15.2 7.55,32.78 v7.57,32.76
  pour Bottom: 2.04,21.06 2.04,17.89 5.59,17.89 5.59,21.06
  pour Bottom (isolate 0.254): 0.25,34.9 0.25,31.18 0.27,31.16 6.2,31.16 7,31.96 8.3,31.96 8.82,32.48 8.82,34.94 8.83,34.95 0.3,34.95 0.26,34.91
VOUT-  (via drill 0.25)
  Top 0.254: U1.3 3.11,27.16
  Top 0.305: U1.3 2.21,27.18 1.95,26.92 1.95,25.71 RSENSE.2 4.08,25.26 v4.31,25.49
  Bottom 0.61: v4.31,25.49 4.31,25.47 | v4.02,24.63 5.98,22.66 5.98,19.32 6.12,19.18 K1.11
  other vias: 3.18,26.35 1.76,26.37
  pour Top (isolate 0.254, no thermals): 1.3,26.75 1.3,24.74 1.62,24.42 4.32,24.42 4.32,26.18 3.75,26.75
  pour Bottom (isolate 0.254, no thermals): 1.27,26.65 1.27,24.36 1.6,24.03 4.48,24.03 5.12,24.67 5.12,26.65
VOUTSENSE  (via drill 0.25, 0.35)
  Top 0.203: 17.04,26.39 17.04,26.41
  Top 0.254: R1.2 12.88,23.52
  Top 0.305: 12.88,23.52 D1.3 | R1.2 13.67,23.61 14.37,24.31 R2.1 15.57,26.39 17.04,26.39 | 17.04,26.41 17.28,26.41 17.28,26.59 17.3,26.59 | 17.3,26.59 v18.82,26.59 | 17.3,26.59 17.3,30.61 v18.61,31.92
  Bottom 0.203: J1.7 18.57,26.8 18.78,26.59 v18.82,26.59 | VOUTSENSE.TP 17.23,31.96
  Bottom 0.254: 17.23,31.96 16.51,32.68 C8.1
  Bottom 0.305: v18.61,31.92 VOUTSENSE.TP
VSOURCE  (via drill 0.25)
  Top 0.15: Q1.1 Q1.3
  Top 0.254: Q1.1 3.68,16.77 | Q1.2 3.21,15.82 2.9,15.52 | Q1.3 3.86,15.64 | Q1.1 1.91,16.77 1.9,16.76 | Q1.1 2.55,15.84 2.89,15.5 | C19.2 3.13,13.56 R43.1 | 3.67,15.45 3.72,15.4 5.18,15.4 5.69,15.91 7.7,15.91 7.96,16.17 U2.6
  Top 0.305: C11.1 1.2,15.84 2.55,15.84
  Top 0.406: 4.24,8.64 C18.2 4.72,8.64 4.72,8.63 | 4.01,11.71 3.13,11.71 C19.2 3.13,13.44 2.83,13.44 | 2.19,11.77 2.19,11.83 | 3.04,8.64 3.04,8.62 | 2.89,15.5 2.9,15.52 3.38,15.04 v3.38,15 | v2.57,13.74 v2.58,13.74 2.94,14.1 R43.1 3.67,15.45
  Top 0.508: 4.08,11.4 4.08,8.7 C18.2 | D2.C 1.9,3.85
  Top 0.61: 4.09,6.75 4.02,6.82 C18.2 3.04,8.64 | 2.19,11.77 C19.2 3.13,9.19 v3.07,9.13 v3.06,9.13
  Top 0.813: 1.71,5.8 D2.C | 1.9,3.85 3.39,3.85 | D2.C 1.7,1.49
  Bottom 0.305: C7.2 2.88,13.43 v2.57,13.74
  other vias: 1.51,3.64 3.69,2.88 3.49,5.76 3.4,4.28 4.62,4.78 3.62,1.44 1.91,6.46 2.64,14.52 2.09,12.61
  pour Route2 (isolate 0.254, no thermals): 6.17,0.94 6.17,4.17 4.11,6.23 4.11,17.63 4.21,17.63 4.12,17.72 -0.76,17.72 -0.76,0.94
  pour Top (isolate 0.254, rank 2): 5.18,6.29 4.79,6.29 4.79,17.41 1.62,17.41 1.62,6.86 1.22,6.86 1.22,0.84 5.18,0.84

### Text on the board
bNames: BATT_DCDC / ROVER R-1 / v8-Sep'24